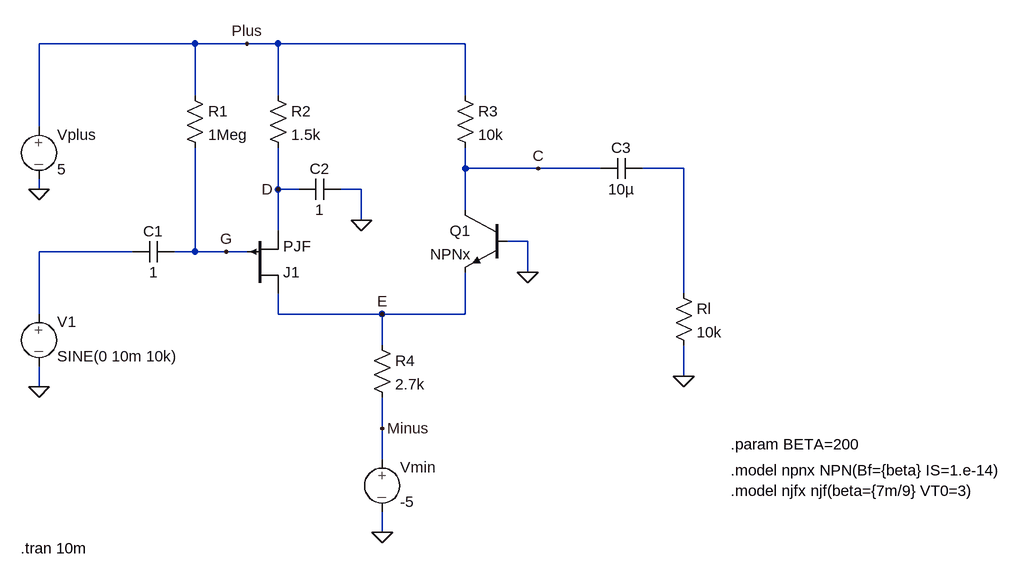
[diagram p0: schematic Klausur_8.1.asc]
Klausur_8.1.asc, the LTspice schematic file:
Version 4
SHEET 1 928 680
WIRE -368 -128 -608 -128
WIRE -288 -128 -368 -128
WIRE -240 -128 -288 -128
WIRE 48 -128 -240 -128
WIRE -368 -48 -368 -128
WIRE -240 -48 -240 -128
WIRE 48 -48 48 -128
WIRE -608 0 -608 -128
WIRE 48 64 48 32
WIRE 160 64 48 64
WIRE 256 64 160 64
WIRE 384 64 320 64
WIRE -608 96 -608 80
WIRE -240 96 -240 32
WIRE -208 96 -240 96
WIRE -112 96 -144 96
WIRE 48 128 48 64
WIRE -112 144 -112 96
WIRE -240 160 -240 96
WIRE 144 176 112 176
WIRE -464 192 -608 192
WIRE -368 192 -368 32
WIRE -368 192 -400 192
WIRE -320 192 -368 192
WIRE -288 192 -320 192
WIRE 144 224 144 176
WIRE 384 256 384 64
WIRE -608 288 -608 192
WIRE -240 288 -240 256
WIRE -80 288 -240 288
WIRE 48 288 48 224
WIRE 48 288 -80 288
WIRE -80 336 -80 288
WIRE 384 384 384 336
WIRE -608 400 -608 368
WIRE -80 464 -80 416
WIRE -80 512 -80 464
WIRE -80 624 -80 592
FLAG -608 400 0
FLAG -608 96 0
FLAG -80 624 0
FLAG -112 144 0
FLAG 144 224 0
FLAG 384 384 0
FLAG -80 288 E
FLAG 160 64 C
FLAG -240 96 D
FLAG -320 192 G
FLAG -288 -128 Plus
FLAG -80 464 Minus
SYMBOL EIT_Semiconductors\\npn 112 128 M0
SYMATTR InstName Q1
SYMATTR Value NPNx
SYMBOL res 32 -64 R0
SYMATTR InstName R3
SYMATTR Value 10k
SYMBOL res -256 -64 R0
SYMATTR InstName R2
SYMATTR Value 1.5k
SYMBOL res -384 -64 R0
SYMATTR InstName R1
SYMATTR Value 1Meg
SYMBOL res -96 320 R0
SYMATTR InstName R4
SYMATTR Value 2.7k
SYMBOL res 368 240 R0
SYMATTR InstName Rl
SYMATTR Value 10k
SYMBOL cap 320 48 R90
WINDOW 0 0 32 VBottom 0
WINDOW 3 32 32 VTop 0
SYMATTR InstName C3
SYMATTR Value 10µ
SYMBOL cap -144 80 R90
WINDOW 0 0 32 VBottom 0
WINDOW 3 32 32 VTop 0
SYMATTR InstName C2
SYMATTR Value 1
SYMBOL cap -400 176 R90
WINDOW 0 0 32 VBottom 0
WINDOW 3 32 32 VTop 0
SYMATTR InstName C1
SYMATTR Value 1
SYMBOL EIT_Semiconductors\\pjf -288 256 M180
SYMATTR InstName J1
SYMBOL source-V -80 496 R0
WINDOW 123 0 0 Left 0
WINDOW 39 0 0 Left 0
SYMATTR InstName Vmin
SYMATTR Value -5
SYMBOL source-V -608 -16 R0
WINDOW 123 0 0 Left 0
WINDOW 39 0 0 Left 0
SYMATTR InstName Vplus
SYMATTR Value 5
SYMBOL source-V -608 272 R0
WINDOW 123 0 0 Left 0
WINDOW 39 0 0 Left 0
SYMATTR InstName V1
SYMATTR Value SINE(0 10m 10k)
TEXT 456 528 Left 0 !.model npnx NPN(Bf={beta} IS=1.e-14)
TEXT 456 488 Left 0 !.param BETA=200
TEXT 456 560 Left 0 !.model njfx njf(beta={7m/9} VT0=3)
TEXT -636 648 Left 0 !.tran 10m

The netlist it stands for:
* Klausur_8.1.asc
Q1 C 0 E 0 NPNx
R3 Plus C 10k
R2 Plus D 1.5k
R1 Plus G 1Meg
R4 E Minus 2.7k
Rl N001 0 10k
C3 N001 C 10µ
C2 0 D 1
C1 G N002 1
J1 E G D PJF
Vmin Minus 0 -5
Vplus Plus 0 5
V1 N002 0 SINE(0 10m 10k)
.model NPN NPN
.model PNP PNP
.lib standard.bjt
.model NJF NJF
.model PJF PJF
.lib standard.jft
.model npnx NPN(Bf={beta} IS=1.e-14)
.param BETA=200
.model njfx njf(beta={7m/9} VT0=3)
.tran 10m
.backanno
.end